# EAGLE schematic FT231X-USBserial (EAGLE 7.7.0)
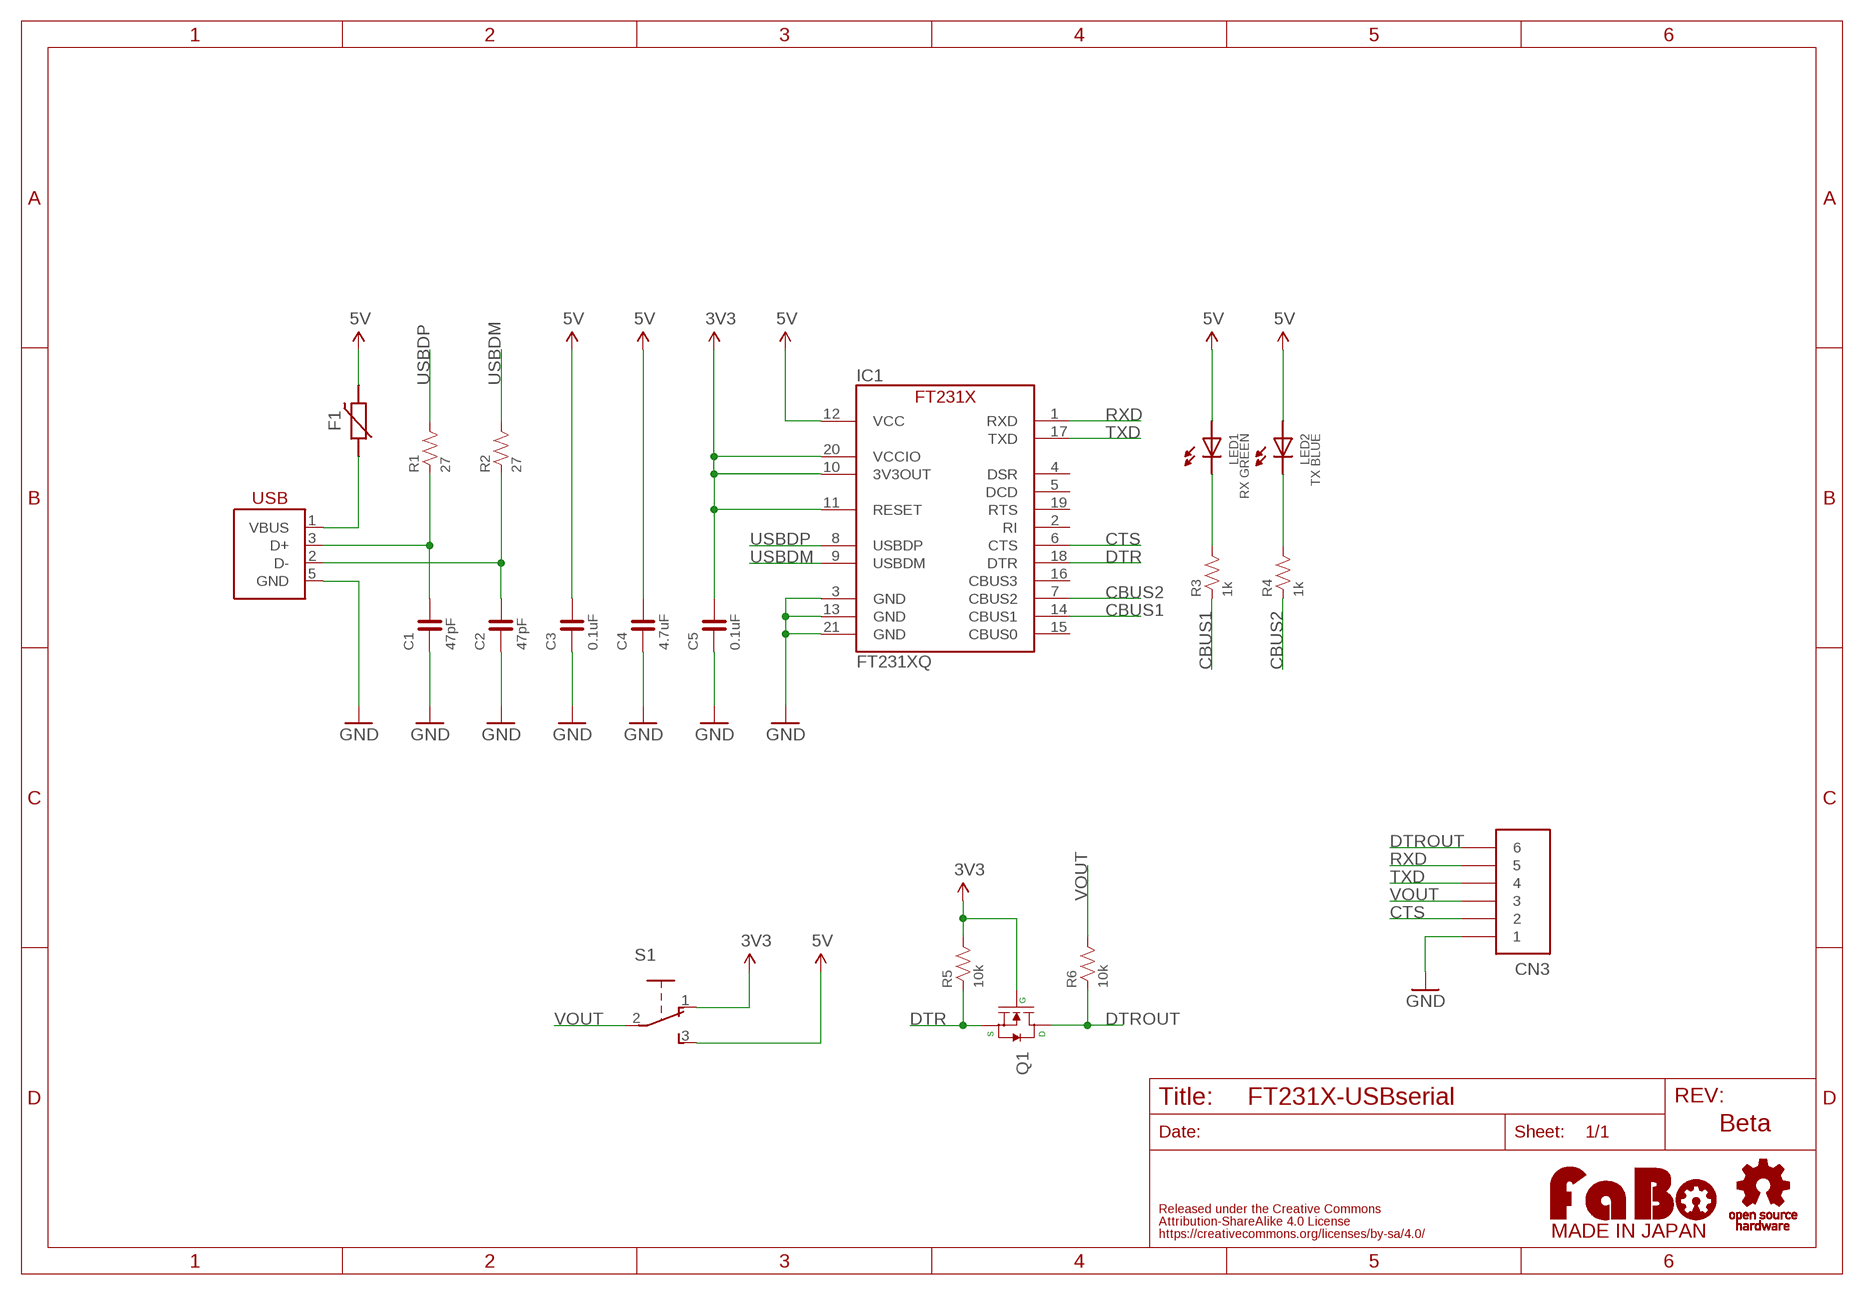
[diagram p0: schematic, sheet 1]

## Parts
C1  47pF  CAPACITOR-0603_NARROW  [0603-NARROW]
C2  47pF  CAPACITOR-0603_NARROW  [0603-NARROW]
C3  0.1uF  CAPACITOR-0603_NARROW  [0603-NARROW]
C4  4.7uF  CAPACITOR-0603_NARROW  [0603-NARROW]
C5  0.1uF  CAPACITOR-0603_NARROW  [0603-NARROW]
CN3  PIN_HEADER_1X6  [PIN_1X6]
F1  POLYSWITCH  [NANOSMDC035F]
IC1  FT231XQ  [QFN-20_FT231X]
LED1  RX GREEN  LED-0603-NARROW  [0603-NARROW]
LED2  TX BLUE  LED-0603-NARROW  [0603-NARROW]
Q1  MOSFET-N  [SOT23-3]
R1  27  RESISTOR-0603-NARROW  [0603-NARROW]
R2  27  RESISTOR-0603-NARROW  [0603-NARROW]
R3  1k  RESISTOR-0603-NARROW  [0603-NARROW]
R4  1k  RESISTOR-0603-NARROW  [0603-NARROW]
R5  10k  RESISTOR-0603-NARROW  [0603-NARROW]
R6  10k  RESISTOR-0603-NARROW  [0603-NARROW]
S1  SLIDE-SSSS810701  [SSSS810701]
U$2  LOGO_FABO-M_BOTTOM  [LOGO_FABO_MS_BOTTOM]
U$3  LOGO_OSHW-M_BOTTOM  [LOGO_OSHW_M_BOTTOM]
USB1  USB-MICRO_B_SMT_HIROSE  [ZX62R-B-5P]

## Nets
3V3: C5.2 IC1.10(3V3OUT) IC1.11(RESET) IC1.20(VCCIO) Q1.1(G) R5.2 S1.1
5V: C3.2 C4.2 F1.2 IC1.12(VCC) LED1.ANODE LED2.ANODE S1.3
CBUS1: IC1.14(CBUS1) R3.1
CBUS2: IC1.7(CBUS2) R4.1
CTS: CN3.2 IC1.6(CTS)
DTR: IC1.18(DTR) Q1.2(S) R5.1
DTROUT: CN3.6 Q1.3(D) R6.1
GND: C1.1 C2.1 C3.1 C4.1 C5.1 CN3.1 IC1.3(GND) IC1.13(GND) IC1.21(GND) USB1.5(GND)
N$3: C2.2 R2.1 USB1.2(D-)
N$4: C1.2 R1.1 USB1.3(D+)
N$33: LED1.CATHODE R3.2
N$35: LED2.CATHODE R4.2
RXD: CN3.5 IC1.1(RXD)
TXD: CN3.4 IC1.17(TXD)
USBDM: IC1.9(USBDM) R2.2
USBDP: IC1.8(USBDP) R1.2
VBUS: F1.1 USB1.1(VBUS)
VOUT: CN3.3 R6.2 S1.2
Unconnected: IC1.2(RI) IC1.4(DSR) IC1.5(DCD) IC1.15(CBUS0) IC1.16(CBUS3) IC1.19(RTS)

## Notes on the sheet
- Beta

## Library data of the parts
C1-C5 = FaBo-Capacitor:CAPACITOR: CAPACITOR
CN3 = FaBo-PIN:PIN_HEADER_1X6
F1 = FaBo-Parts:POLYSWITCH
IC1 = FaBo-USB:FT231X
LED1 LED2 = FaBo-LED:LED
Q1 = FaBo-etc:MOSFET-N
R1-R6 = FaBo-Resistors:RESISTOR: RESISTOR
S1 = FaBo-Switch:SLIDE
U$2 = FaBo-Logo:LOGO_FABO
U$3 = FaBo-Logo:LOGO_OSHW
USB1 = FaBo-USB:USB